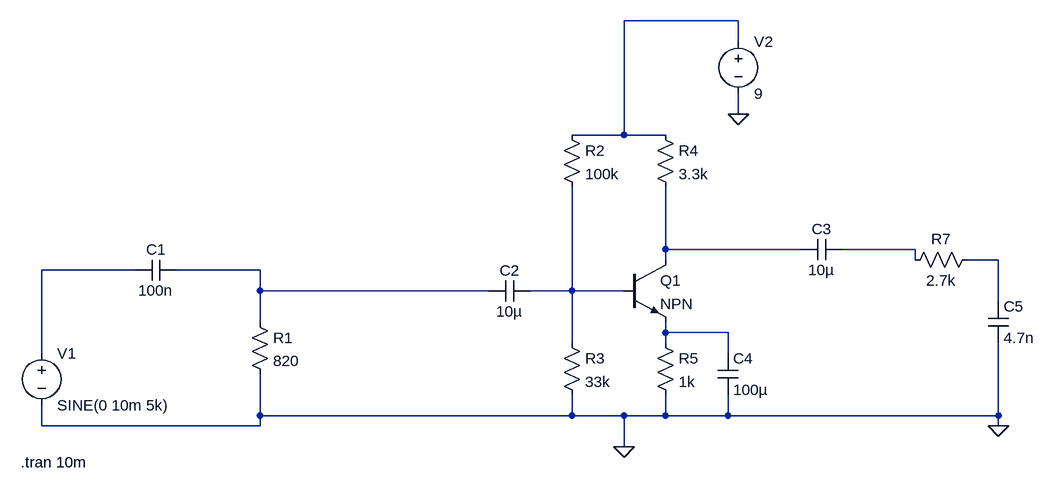
[diagram p0: schematic Full_Circuit.asc]
Full_Circuit.asc, the LTspice schematic file:
Version 4.1
SHEET 1 1808 680
WIRE 992 -384 816 -384
WIRE 992 -352 992 -384
WIRE 992 -240 992 -272
WIRE 816 -208 816 -384
WIRE 816 -208 736 -208
WIRE 880 -208 816 -208
WIRE 880 -32 880 -128
WIRE 1088 -32 880 -32
WIRE 1264 -32 1152 -32
WIRE 880 -16 880 -32
WIRE 1264 -16 1264 -32
WIRE 1392 -16 1344 -16
WIRE 64 0 -80 0
WIRE 256 0 128 0
WIRE 256 32 256 0
WIRE 608 32 256 32
WIRE 736 32 736 -128
WIRE 736 32 672 32
WIRE 816 32 736 32
WIRE 1392 48 1392 -16
WIRE 256 80 256 32
WIRE 880 96 880 80
WIRE 976 96 880 96
WIRE 736 112 736 32
WIRE 880 112 880 96
WIRE -80 128 -80 0
WIRE 976 128 976 96
WIRE 256 224 256 160
WIRE 736 224 736 192
WIRE 736 224 256 224
WIRE 816 224 736 224
WIRE 880 224 880 192
WIRE 880 224 816 224
WIRE 976 224 976 192
WIRE 976 224 880 224
WIRE 1392 224 1392 112
WIRE 1392 224 976 224
WIRE -80 240 -80 208
WIRE 256 240 256 224
WIRE 256 240 -80 240
WIRE 1392 240 1392 224
WIRE 816 272 816 224
FLAG 992 -240 0
FLAG 816 272 0
FLAG 1392 240 0
SYMBOL cap 128 -16 R90
WINDOW 0 0 32 VBottom 2
WINDOW 3 32 32 VTop 2
SYMATTR InstName C1
SYMATTR Value 100n
SYMBOL res 240 64 R0
SYMATTR InstName R1
SYMATTR Value 820
SYMBOL npn 816 -16 R0
SYMATTR InstName Q1
SYMBOL cap 672 16 R90
WINDOW 0 0 32 VBottom 2
WINDOW 3 32 32 VTop 2
SYMATTR InstName C2
SYMATTR Value 10µ
SYMBOL cap 1152 -48 R90
WINDOW 0 0 32 VBottom 2
WINDOW 3 32 32 VTop 2
SYMATTR InstName C3
SYMATTR Value 10µ
SYMBOL cap 960 128 R0
SYMATTR InstName C4
SYMATTR Value 100µ
SYMBOL res 720 -224 R0
SYMATTR InstName R2
SYMATTR Value 100k
SYMBOL res 720 96 R0
SYMATTR InstName R3
SYMATTR Value 33k
SYMBOL res 864 -224 R0
SYMATTR InstName R4
SYMATTR Value 3.3k
SYMBOL res 864 96 R0
SYMATTR InstName R5
SYMATTR Value 1k
SYMBOL voltage 992 -368 R0
WINDOW 123 0 0 Left 0
WINDOW 39 0 0 Left 0
SYMATTR InstName V2
SYMATTR Value 9
SYMBOL cap 1376 48 R0
SYMATTR InstName C5
SYMATTR Value 4.7n
SYMBOL res 1360 -32 R90
WINDOW 0 0 56 VBottom 2
WINDOW 3 32 56 VTop 2
SYMATTR InstName R7
SYMATTR Value 2.7k
SYMBOL voltage -80 112 R0
WINDOW 123 0 0 Left 0
WINDOW 39 0 0 Left 0
SYMATTR InstName V1
SYMATTR Value SINE(0 10m 5k)
TEXT -112 296 Left 2 !.tran 10m

The netlist it stands for:
* Full_Circuit.asc
C1 N006 N005 100n
R1 N006 0 820
Q1 N002 N007 N008 0 NPN
C2 N007 N006 10µ
C3 N003 N002 10µ
C4 N008 0 100µ
R2 N001 N007 100k
R3 N007 0 33k
R4 N001 N002 3.3k
R5 N008 0 1k
V2 N001 0 9
C5 N004 0 4.7n
R7 N004 N003 2.7k
V1 N005 0 SINE(0 10m 5k)
.model NPN NPN
.model PNP PNP
.lib standard.bjt
.tran 10m
.backanno
.end